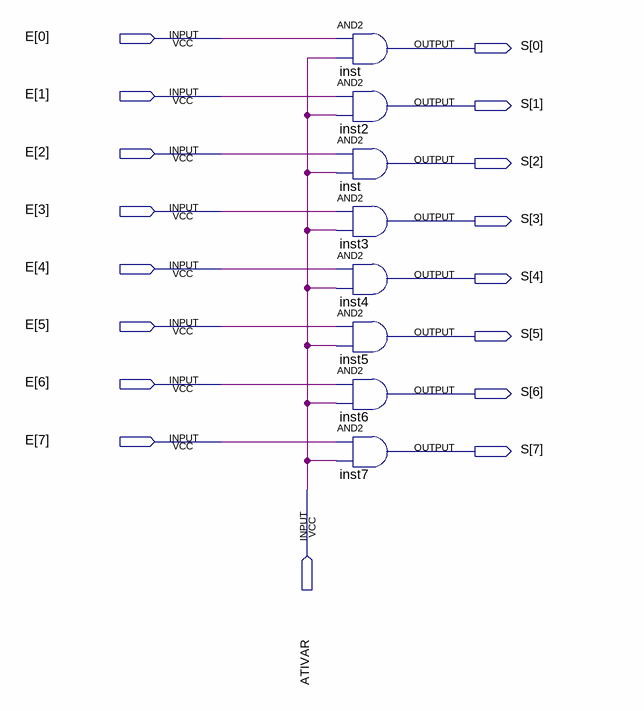
[diagram p0: schematic sheet]
// Quartus schematic row_a.bdf as structural Verilog: 8 symbols, 17 pins
module row_a (
  input  [7:0] E,
  input  ATIVAR,
  output [7:0] S
);

  and inst (S[0], E[0], ATIVAR);
  and inst2 (S[1], E[1], ATIVAR);
  and inst_dup2 (S[2], E[2], ATIVAR);
  and inst3 (S[3], E[3], ATIVAR);
  and inst4 (S[4], E[4], ATIVAR);
  and inst5 (S[5], E[5], ATIVAR);
  and inst6 (S[6], E[6], ATIVAR);
  and inst7 (S[7], E[7], ATIVAR);
endmodule
